# Altium project viper_eagle_rep.PrjPcb
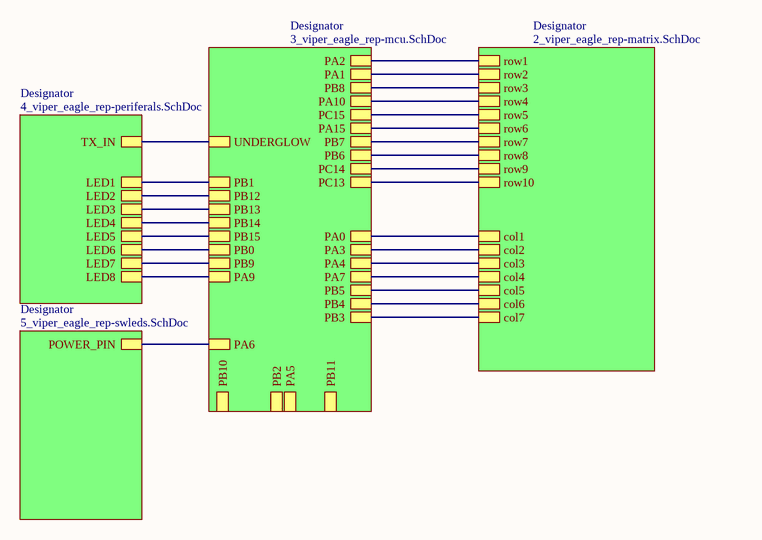
[diagram p0: 1_viper_eagle_rep_top.SchDoc]
Revision: B2; ProjectTitle: Viper/Eagle Rep
5 sheets, 371 parts. Net scope: hierarchical (ports join the sheet entries above them; power ports are global).
Board file: viper_eagle_rep.PcbDoc
Sheets:
  1_viper_eagle_rep_top.SchDoc
    Designator = 3_viper_eagle_rep-mcu.SchDoc
    Designator = 2_viper_eagle_rep-matrix.SchDoc
    Designator = 4_viper_eagle_rep-periferals.SchDoc
    Designator = 5_viper_eagle_rep-swleds.SchDoc

## Sheet 1_viper_eagle_rep_top.SchDoc: =ProjectTitle
size A4; Address1: github.com/4pplet/eagle_viper; Address2: Licence: CERN-OHL-S; Address4: www.4pplet.com; Revision: B2; SheetNumber: 1; SheetTotal: 5; ProjectName: waffling60

### Sub-sheets
Designator = 3_viper_eagle_rep-mcu.SchDoc: PB10, PB3, PB2, PB9, PB0, PB7, PA15, PB6, PC14, PB13, UNDERGLOW, PB12, PB11, PA0, PA6, PC15, PB1, PB4, PA10, PC13, PB5, PB14, PA9, PA1, PA2, PB15, PB8, PA4, PA3, PA5, PA7
Designator = 2_viper_eagle_rep-matrix.SchDoc: col5, col7, col3, col1, row3, row1, row4, row2, row5, col4, col2, col6, row9, row7, row6, row8, row10
Designator = 4_viper_eagle_rep-periferals.SchDoc: TX_IN, LED4, LED7, LED3, LED5, LED1, LED6, LED8, LED2
Designator = 5_viper_eagle_rep-swleds.SchDoc: POWER_PIN

### Nets
col1: sheet Designator/PA0, sheet Designator/col1
col2: sheet Designator/PA3, sheet Designator/col2
col3: sheet Designator/PA4, sheet Designator/col3
col4: sheet Designator/PA7, sheet Designator/col4
col5: sheet Designator/PB5, sheet Designator/col5
col6: sheet Designator/PB4, sheet Designator/col6
col7: sheet Designator/PB3, sheet Designator/col7
PA1: sheet Designator/PA1, sheet Designator/row2
PA2: sheet Designator/PA2, sheet Designator/row1
PA9: sheet Designator/PA9, sheet Designator/LED8
PA10: sheet Designator/PA10, sheet Designator/row4
PA15: sheet Designator/PA15, sheet Designator/row6
PB0: sheet Designator/PB0, sheet Designator/LED6
PB1: sheet Designator/PB1, sheet Designator/LED1
PB6: sheet Designator/PB6, sheet Designator/row8
PB7: sheet Designator/PB7, sheet Designator/row7
PB8: sheet Designator/PB8, sheet Designator/row3
PB9: sheet Designator/PB9, sheet Designator/LED7
PB12: sheet Designator/PB12, sheet Designator/LED2
PB13: sheet Designator/PB13, sheet Designator/LED3
PB14: sheet Designator/PB14, sheet Designator/LED4
PB15: sheet Designator/PB15, sheet Designator/LED5
PC13: sheet Designator/PC13, sheet Designator/row10
PC14: sheet Designator/PC14, sheet Designator/row9
PC15: sheet Designator/PC15, sheet Designator/row5
switch_led: sheet Designator/PA6, sheet Designator/POWER_PIN
NetLED406_4: sheet Designator/UNDERGLOW, sheet Designator/TX_IN

### Notes on the sheet
- Title
- Size:
- Date:
- A4
- Number:
- Time:
- Revision:
- Sheet
- of
- File:

## Sheet 3_viper_eagle_rep-mcu.SchDoc: =ProjectTitle
size A4; Address1: github.com/4pplet/eagle_viper; Address2: Licence: CERN-OHL-S; Address4: www.4pplet.com; Revision: B2; SheetNumber: 3; SheetTotal: 5
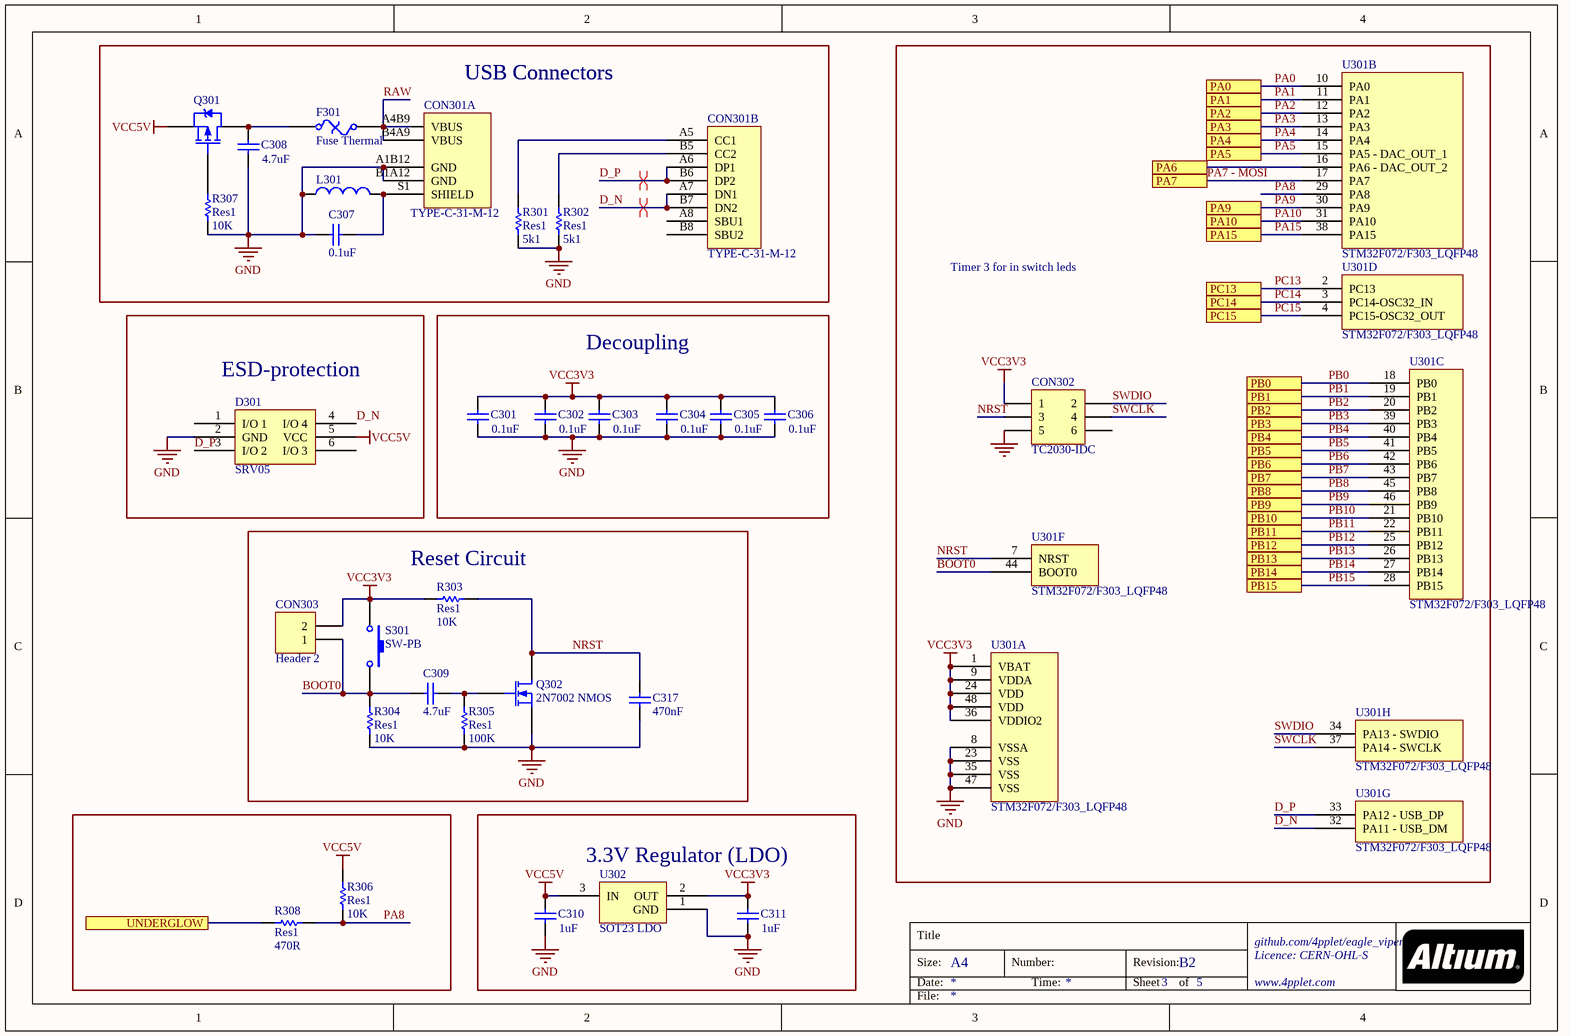
[diagram p1: 3_viper_eagle_rep-mcu.SchDoc]

### Parts
C301  value 0.1uF  [C0603[1608]]
C302  value 0.1uF  [C0603[1608]]
C303  value 0.1uF  [C0603[1608]]
C304  value 0.1uF  [C0603[1608]]
C305  value 0.1uF  [C0603[1608]]
C306  value 0.1uF  [C0603[1608]]
C307  value 0.1uF  [C0603[1608]]
C308  value 4.7uF  [C0603[1608]]
C309  value 4.7uF  [C0603[1608]]
C310  value 1uF  [C0603[1608]]
C311  value 1uF  [C0603[1608]]
C317  value 470nF  [C0603[1608]]
CON301  TYPE-C-31-M-12  [TYPE-C-31-M-12]  (parts A,B of 2)
CON302  TC2030-IDC  [TC2030-IDC-NL]  (no BOM)
CON303  Header 2  [HDR1X2]  (no BOM)
D301  SRV05  [SOT-23-6]
F301  Fuse Thermal  [C1206[3216]]
L301  Inductor  [L0805]  (value not drawn)
Q301  PMOS-2  [SOT-23-3]  (value not drawn)
Q302  2N7002 NMOS  [SOT-23-3]
R301  Res1  value 5k1  [R0603[1608]]
R302  Res1  value 5k1  [R0603[1608]]
R303  Res1  value 10K  [R0603[1608]]
R304  Res1  value 10K  [R0603[1608]]
R305  Res1  value 100K  [R0603[1608]]
R306  Res1  value 10K  [R0603[1608]]
R307  Res1  value 10K  [R0603[1608]]
R308  Res1  value 470R  [R0603[1608]]
S301  SW-PB  [XKB Switch]
U301  STM32F072/F303_LQFP48  [STM32 - COMBO 7X7MM]  (parts A,B,C,D,F,G,H of 8)
U302  SOT23 LDO  [SOT-23-3]

### Blocks framed on the sheet
Timer 3 for in switch leds: CON302 U301
ESD-protection: D301
Decoupling: C301-C306
Reset Circuit: C309 C317 CON303 Q302 R303-R305 S301
3.3V Regulator (LDO): C310 C311 U302

### Ports
PA0, PA1, PA2, PA3, PA4, PA5, PA6, PA7, PA9, PA10, PA15, PB0, PB1, PB2, PB3, PB4, PB5, PB6, PB7, PB8, PB9, PB10, PB11, PB12, PB13, PB14, PB15, PC13, PC14, PC15, UNDERGLOW

### Nets
GND: C301.1 C302.1 C303.1 C304.1 C305.1 C306.1 C307.1 C308.1 C310.1 C311.1 C317.2 CON301.A1B12(GND) CON301.B1A12(GND) CON302.5 D301.2(GND) L301.1 Q302.2(S) R301.2 R302.2 R304.2 R305.2 R307.2 U301.8(VSSA) U301.23(VSS) U301.35(VSS) U301.47(VSS) U302.1(GND)
VCC3V3: C301.2 C302.2 C303.2 C304.2 C305.2 C306.2 C311.2 CON302.1 CON303.2 R303.1 S301.1 U301.1(VBAT) U301.9(VDDA) U301.24(VDD) U301.36(VDDIO2) U301.48(VDD) U302.2(OUT)
VCC5V: C310.2 D301.5(VCC) Q301.2(S) R306.1 U302.3(IN)
BOOT0: C309.2 CON303.1 R304.1 S301.2 U301.44(BOOT0)
D_N: CON301.A7(DN1) CON301.B7(DN2) D301.4(I/O_4) U301.32(PA11_-_USB_DM)
D_P: CON301.A6(DP1) CON301.B6(DP2) D301.3(I/O_2) U301.33(PA12_-_USB_DP)
NRST: C317.1 CON302.3 Q302.3(D) R303.2 U301.7(NRST)
PA0: U301.10(PA0) ; port PA0  [project net col1]
PA1: U301.11(PA1) ; port PA1
PA2: U301.12(PA2) ; port PA2
PA3: U301.13(PA3) ; port PA3  [project net col2]
PA4: U301.14(PA4) ; port PA4  [project net col3]
PA5: U301.15(PA5_-_DAC_OUT_1) ; port PA5
PA7 - MOSI: U301.17(PA7) ; port PA7  [project net col4]
PA8: R306.2 R308.1 U301.29(PA8)
PA9: U301.30(PA9) ; port PA9
PA10: U301.31(PA10) ; port PA10
PA15: U301.38(PA15) ; port PA15
PB0: U301.18(PB0) ; port PB0
PB1: U301.19(PB1) ; port PB1
PB2: U301.20(PB2) ; port PB2
PB3: U301.39(PB3) ; port PB3  [project net col7]
PB4: U301.40(PB4) ; port PB4  [project net col6]
PB5: U301.41(PB5) ; port PB5  [project net col5]
PB6: U301.42(PB6) ; port PB6
PB7: U301.43(PB7) ; port PB7
PB8: U301.45(PB8) ; port PB8
PB9: U301.46(PB9) ; port PB9
PB10: U301.21(PB10) ; port PB10
PB11: U301.22(PB11) ; port PB11
PB12: U301.25(PB12) ; port PB12
PB13: U301.26(PB13) ; port PB13
PB14: U301.27(PB14) ; port PB14
PB15: U301.28(PB15) ; port PB15
PC13: U301.2(PC13) ; port PC13
PC14: U301.3(PC14-OSC32_IN) ; port PC14
PC15: U301.4(PC15-OSC32_OUT) ; port PC15
RAW: CON301.A4B9(VBUS) CON301.B4A9(VBUS) F301.2
SWCLK: CON302.4 U301.37(PA14_-_SWCLK)
SWDIO: CON302.2 U301.34(PA13_-_SWDIO)
switch_led: U301.16(PA6_-_DAC_OUT_2) ; port PA6
NetC307_2: C307.2 CON301.S1(SHIELD) L301.2
NetC308_2: C308.2 F301.1 Q301.3(D)
NetC309_1: C309.1 Q302.1(G) R305.1
NetCON301_A5: CON301.A5(CC1) R301.1
NetCON301_B5: CON301.B5(CC2) R302.1
NetLED406_4: R308.2 ; port UNDERGLOW
NetQ301_1: Q301.1(G) R307.1

Not connected (* = marked no-connect by the designer): CON301 A8(SBU1) B8(SBU2); CON302 6; D301 1(I/O_1) 6(I/O_3)

### Layout directives
differential pair: D_N, D_P

### Notes on the sheet
- USB Connectors
- Title
- Size:
- Date:
- A4
- Number:
- Time:
- Revision:
- Sheet
- of
- File:

### Library data of the parts
C301-C307 = Cap: Capacitor; MRF.Part: CC0603KRX7R9BB104; LCSC MFG: YAGEO; Version: 0603 imperial; LCSC Part #: C14663
C308 C309 = Cap: Capacitor; MRF.Part: CL10A475KO8NNNC; LCSC MFG: Samsung Electro-Mechanics; Version: 0603 imperial; LCSC Part #: C19666
C310 C311 = Cap: Capacitor; MRF.Part: CL10A105KB8NNNC; LCSC MFG: Samsung Electro-Mechanics; Version: 0603 imperial; LCSC Part #: C15849
C317 = Cap: Capacitor; MRF.Part: CL10B474KA8NNNC; LCSC MFG: Samsung Electro-Mechanics; Version: 0603 imperial; LCSC Part #: C1623
CON301 = TYPE-C-31-M-12: LCSC MFG: Korean Hroparts Elec; LCSC Part #: C165948; MRF.Part: TYPE-C-31-M-12
CON302 = Header 3X2: Header, 3-Pin, Dual row
CON303 = Header 2: Header, 2-Pin
D301 = SRV05: MRF.Part: SRV05-4-P-T7; LCSC MFG: ProTek Devices; LCSC Part #: C85364
F301 = Fuse Thermal: Thermal Fuse; MRF.Part: ASMD1206-050; LCSC MFG: Shenzhen JDT Fuse; LCSC Part #: C135338
L301 = Inductor: MRF.Part: GZ2012D101TF; LCSC MFG: Sunlord; LCSC Part #: C1015; Version: 0806 imperial
Q301 = PMOS-2: P-Channel Power MOSFET; MRF.Part: SI2301CDS-T1-GE3; LCSC MFG: Vishay Intertech; LCSC Part #: C10487; Version: SOT23-3
Q302 = MOSFET-N: N-Channel MOSFET; LCSC MFG: Changjiang Electronics Tech (CJ); LCSC Part #: C8545; MRF.Part: 2N7002
R301 R302 = Res1: Resistor; MRF.Part: 0603WAF5101T5E; LCSC MFG: Uniroyal Elec; Version: 0603 imperial; LCSC Part #: C23186
R303 R304 R306 R307 = Res1: Resistor; MRF.Part: 0603WAF1002T5E; LCSC MFG: Uniroyal Elec; Version: 0603 imperial; LCSC Part #: C25804
R305 = Res1: Resistor; MRF.Part: 0603WAF1003T5E; LCSC MFG: Uniroyal Elec; Version: 0603 imperial; LCSC Part #: C25803
R308 = Res1: Resistor; MRF.Part: 0603WAF4700T5E; LCSC MFG: Uniroyal Elec; Version: 0603 imperial; LCSC Part #: C23179
S301 = SW-PB: Switch; MRF.Part: TS-1187A-C-D-B; LCSC MFG: XKB Enterprise; LCSC Part #: C318888
U301 = STM32F072/F303_LQFP48: MRF.Part: APM32F072CBT6; LCSC MFG: Geehy; LCSC Part #: C915660
U302 = SOT23 LDO: MRF.Part: XC6206P332MR; LCSC MFG: Torex Semicon; LCSC Part #: C5446

## Sheet 2_viper_eagle_rep-matrix.SchDoc: =ProjectTitle
size A3; Address1: github.com/4pplet/eagle_viper; Address2: Licence: CERN-OHL-S; Address4: www.4pplet.com; Revision: B2; SheetNumber: 2; SheetTotal: 5
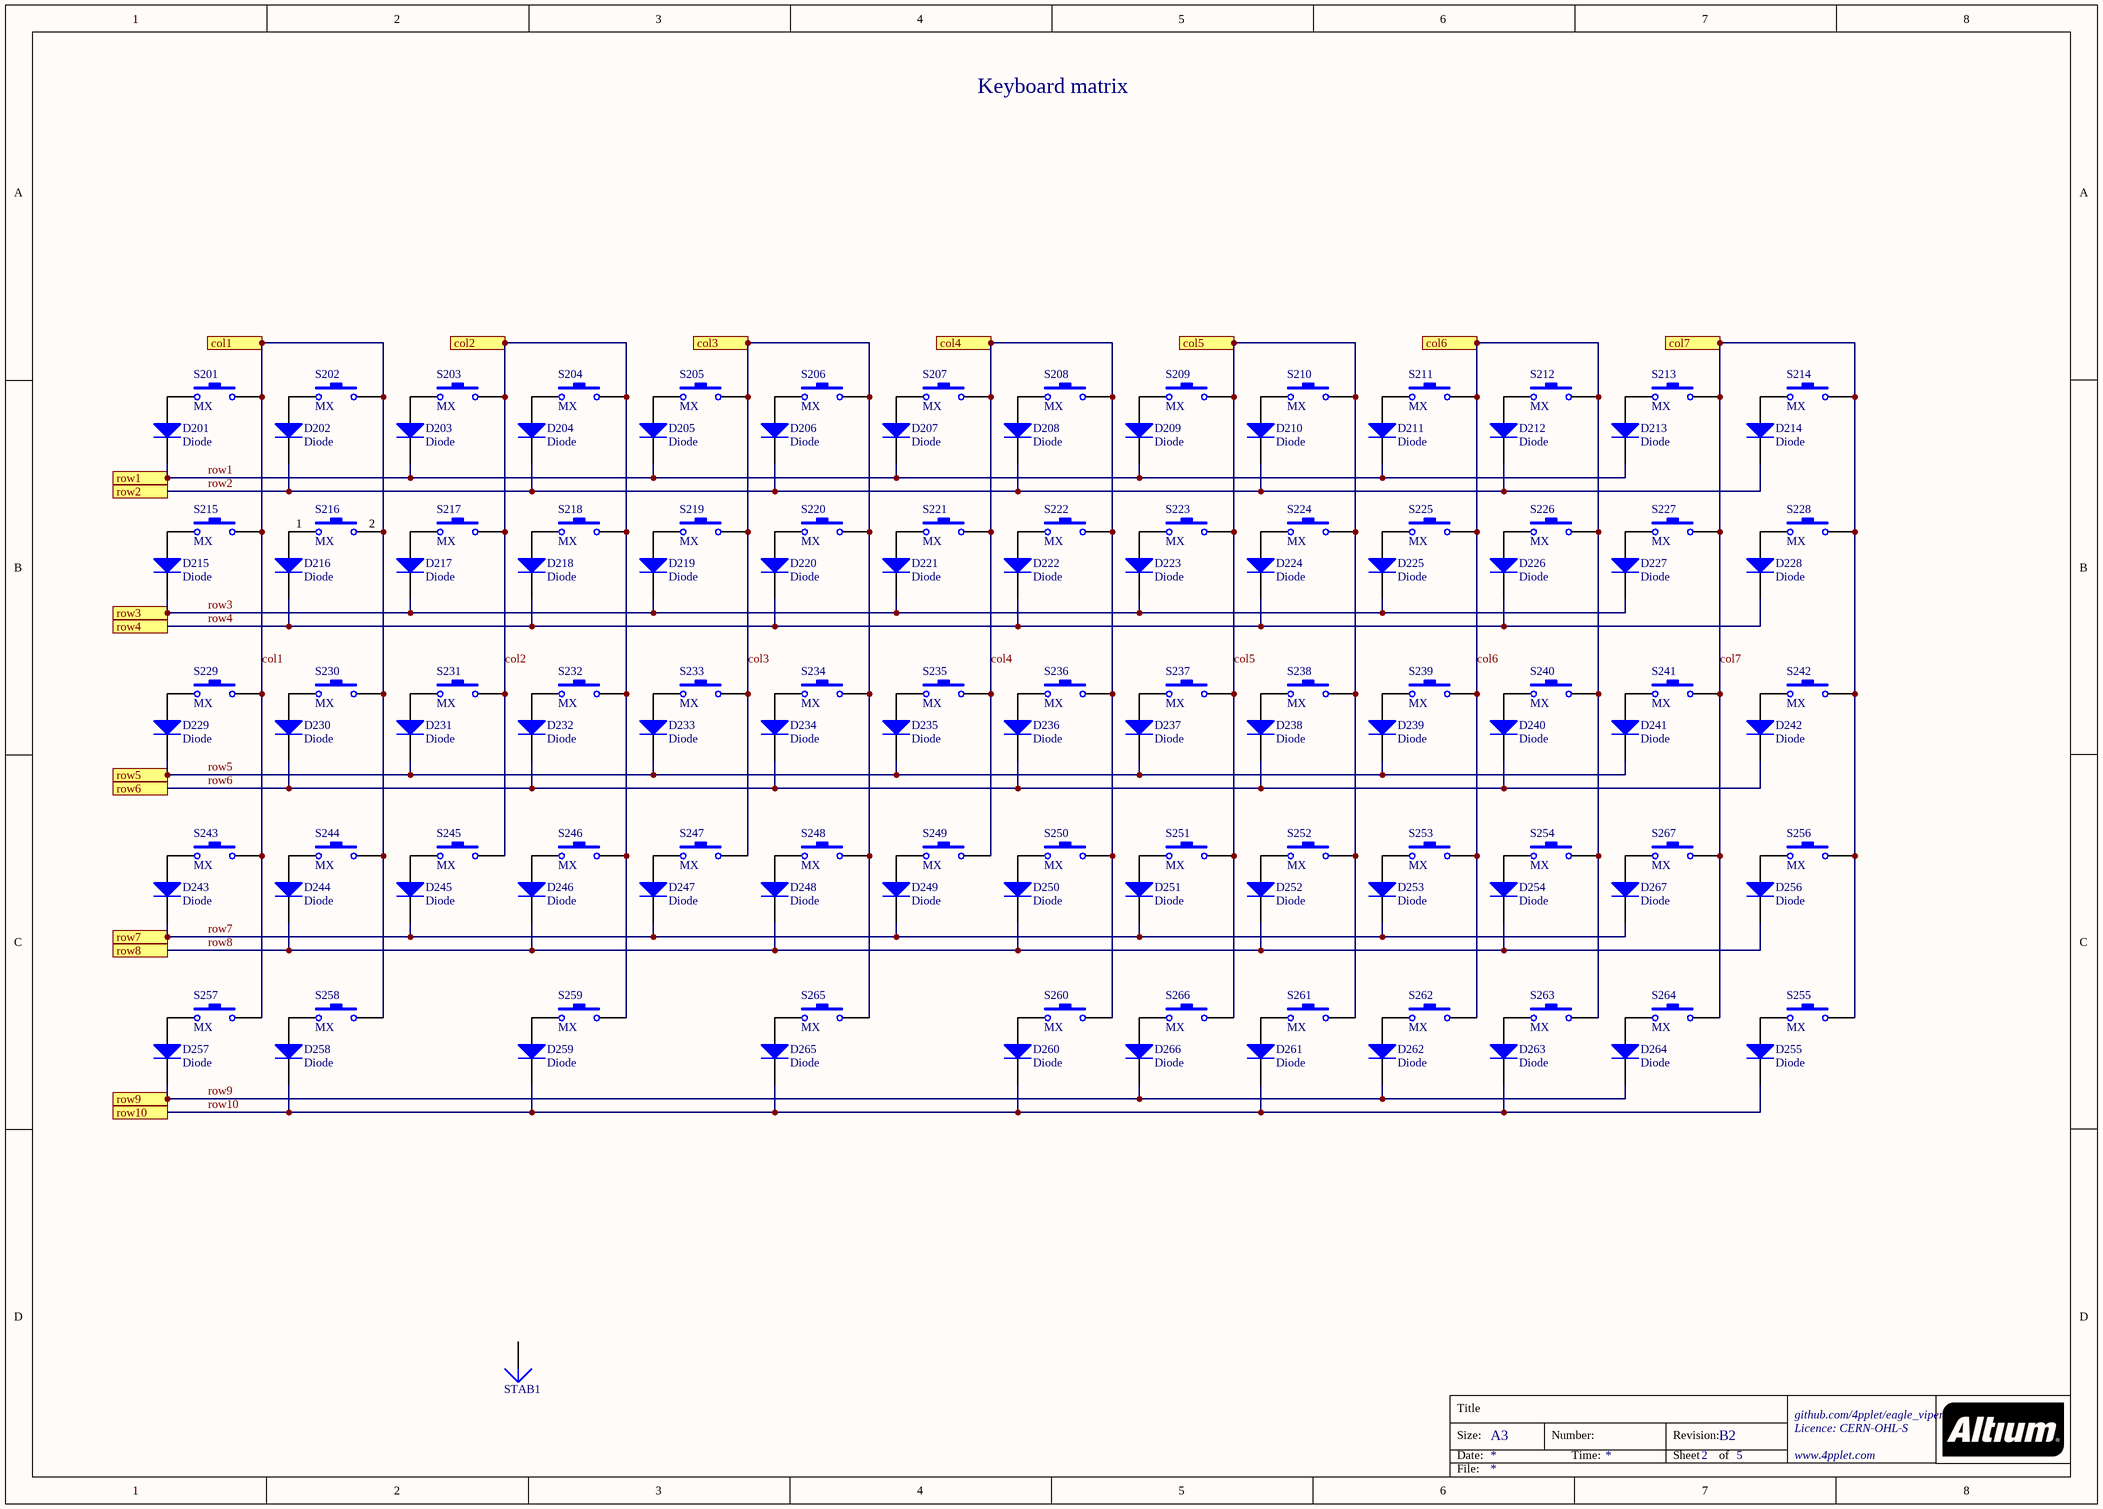
[diagram p2: 2_viper_eagle_rep-matrix.SchDoc]

### Parts
D201  Diode  [SOD-123]
D202  Diode  [SOD-123]
D203  Diode  [SOD-123]
D204  Diode  [SOD-123]
D205  Diode  [SOD-123]
D206  Diode  [SOD-123]
D207  Diode  [SOD-123]
D208  Diode  [SOD-123]
D209  Diode  [SOD-123]
D210  Diode  [SOD-123]
D211  Diode  [SOD-123]
D212  Diode  [SOD-123]
D213  Diode  [SOD-123]
D214  Diode  [SOD-123]
D215  Diode  [SOD-123]
D216  Diode  [SOD-123]
D217  Diode  [SOD-123]
D218  Diode  [SOD-123]
D219  Diode  [SOD-123]
D220  Diode  [SOD-123]
D221  Diode  [SOD-123]
D222  Diode  [SOD-123]
D223  Diode  [SOD-123]
D224  Diode  [SOD-123]
D225  Diode  [SOD-123]
D226  Diode  [SOD-123]
D227  Diode  [SOD-123]
D228  Diode  [SOD-123]
D229  Diode  [SOD-123]
D230  Diode  [SOD-123]
D231  Diode  [SOD-123]
D232  Diode  [SOD-123]
D233  Diode  [SOD-123]
D234  Diode  [SOD-123]
D235  Diode  [SOD-123]
D236  Diode  [SOD-123]
D237  Diode  [SOD-123]
D238  Diode  [SOD-123]
D239  Diode  [SOD-123]
D240  Diode  [SOD-123]
D241  Diode  [SOD-123]
D242  Diode  [SOD-123]
D243  Diode  [SOD-123]
D244  Diode  [SOD-123]
D245  Diode  [SOD-123]
D246  Diode  [SOD-123]
D247  Diode  [SOD-123]
D248  Diode  [SOD-123]
D249  Diode  [SOD-123]
D250  Diode  [SOD-123]
D251  Diode  [SOD-123]
D252  Diode  [SOD-123]
D253  Diode  [SOD-123]
D254  Diode  [SOD-123]
D255  Diode  [SOD-123]
D256  Diode  [SOD-123]
D257  Diode  [SOD-123]
D258  Diode  [SOD-123]
D259  Diode  [SOD-123]
D260  Diode  [SOD-123]
D261  Diode  [SOD-123]
D262  Diode  [SOD-123]
D263  Diode  [SOD-123]
D264  Diode  [SOD-123]
D265  Diode  [SOD-123]
D266  Diode  [SOD-123]
D267  Diode  [SOD-123]
S201  MX  [MX-switch - switched pol]  (no BOM)
S202  MX  [MX-switch - switched pol - connector]  (no BOM)
S203  MX  [MX-switch - switched pol]  (no BOM)
S204  MX  [MX-switch - switched pol]  (no BOM)
S205  MX  [MX-switch - switched pol]  (no BOM)
S206  MX  [MX-switch - switched pol]  (no BOM)
S207  MX  [MX-switch]  (no BOM)
S208  MX  [MX-switch - switched pol]  (no BOM)
S209  MX  [MX-switch - switched pol]  (no BOM)
S210  MX  [MX-switch - switched pol]  (no BOM)
S211  MX  [MX-switch - switched pol]  (no BOM)
S212  MX  [MX-switch - switched pol]  (no BOM)
S213  MX  [MX-switch - switched pol]  (no BOM)
S214  MX  [MX-switch]  (no BOM)
S215  MX  [MX-switch - 1.5U]  (no BOM)
S216  MX  [MX-switch - switched pol]  (no BOM)
S217  MX  [MX-switch - switched pol]  (no BOM)
S218  MX  [MX-switch - switched pol]  (no BOM)
S219  MX  [MX-switch - switched pol]  (no BOM)
S220  MX  [MX-switch]  (no BOM)
S221  MX  [MX-switch - switched pol]  (no BOM)
S222  MX  [MX-switch - switched pol]  (no BOM)
S223  MX  [MX-switch - switched pol]  (no BOM)
S224  MX  [MX-switch - switched pol]  (no BOM)
S225  MX  [MX-switch - switched pol]  (no BOM)
S226  MX  [MX-switch]  (no BOM)
S227  MX  [MX-switch - switched pol]  (no BOM)
S228  MX  [MX-switch - backspace]  (no BOM)
S229  MX  [MX-switch - CAPS]  (no BOM)
S230  MX  [MX-switch - switched pol]  (no BOM)
S231  MX  [MX-switch - switched pol]  (no BOM)
S232  MX  [MX-switch - switched pol]  (no BOM)
S233  MX  [MX-switch - switched pol]  (no BOM)
S234  MX  [MX-switch - switched pol]  (no BOM)
S235  MX  [MX-switch - switched pol]  (no BOM)
S236  MX  [MX-switch - switched pol]  (no BOM)
S237  MX  [MX-switch - switched pol]  (no BOM)
S238  MX  [MX-switch - switched pol]  (no BOM)
S239  MX  [MX-switch]  (no BOM)
S240  MX  [MX-switch - switched pol]  (no BOM)
S241  MX  [MX-switch]  (no BOM)
S242  MX  [MX-switch - 1.5U]  (no BOM)
S243  MX  [MX-switch - Left shift]  (no BOM)
S244  MX  [MX-switch]  (no BOM)
S245  MX  [MX-switch - switched pol]  (no BOM)
S246  MX  [MX-switch - switched pol]  (no BOM)
S247  MX  [MX-switch - switched pol]  (no BOM)
S248  MX  [MX-switch - switched pol]  (no BOM)
S249  MX  [MX-switch - switched pol]  (no BOM)
S250  MX  [MX-switch - switched pol]  (no BOM)
S251  MX  [MX-switch - switched pol]  (no BOM)
S252  MX  [MX-switch - switched pol]  (no BOM)
S253  MX  [MX-switch - switched pol]  (no BOM)
S254  MX  [MX-switch - switched pol]  (no BOM)
S255  MX  [MX-switch]  (no BOM)
S256  MX  [MX-switch - Enter - rotated ISO]  (no BOM)
S257  MX  [MX-switch - 1.5u MOD-L]  (no BOM)
S258  MX  [MX-switch - 1u MOD-L]  (no BOM)
S259  MX  [MX-switch - 1.5u MOD-L]  (no BOM)
S260  MX  [MX-switch - Space_V2]  (no BOM)
S261  MX  [MX-switch]  (no BOM)
S262  MX  [MX-switch - 1.5u MOD-R]  (no BOM)
S263  MX  [MX-switch - 1u MOD-R]  (no BOM)
S264  MX  [MX-switch - 1.5u MOD-R]  (no BOM)
S265  MX  [MX-switch - 3U - rotated stab]  (no BOM)
S266  MX  [MX-switch - 3U - rotated stab]  (no BOM)
S267  MX  [MX-switch - right shift - rotated stab]  (no BOM)
STAB1  Plug  [Stab 10U]  (value not drawn)  (no BOM)

### Ports
col1, col2, col3, col4, col5, col6, col7, row1, row2, row3, row4, row5, row6, row7, row8, row9, row10

### Nets
col1: S201.2 S202.2 S215.1 S216.2 S229.2 S230.2 S243.2 S244.2 S257.1 S258.2 ; port col1
col2: S203.2 S204.2 S217.2 S218.2 S231.2 S232.2 S245.2 S246.2 S259.1 ; port col2
col3: S205.2 S206.2 S219.2 S220.2 S233.2 S234.2 S247.2 S248.2 S265.2 ; port col3
col4: S207.2 S208.2 S221.2 S222.2 S235.2 S236.2 S249.2 S250.2 S260.1 ; port col4
col5: S209.2 S210.2 S223.2 S224.2 S237.2 S238.2 S251.2 S252.2 S261.2 S266.2 ; port col5
col6: S211.2 S212.2 S225.2 S226.2 S239.2 S240.2 S253.2 S254.2 S262.1 S263.1 ; port col6
col7: S213.2 S214.2 S227.2 S228.1 S241.2 S242.2 S255.2 S256.2 S264.2 S267.2 ; port col7
row1: D201.2(K) D203.2(K) D205.2(K) D207.2(K) D209.2(K) D211.2(K) D213.2(K) ; port row1  [project net PA2]
row2: D202.2(K) D204.2(K) D206.2(K) D208.2(K) D210.2(K) D212.2(K) D214.2(K) ; port row2  [project net PA1]
row3: D215.2(K) D217.2(K) D219.2(K) D221.2(K) D223.2(K) D225.2(K) D227.2(K) ; port row3  [project net PB8]
row4: D216.2(K) D218.2(K) D220.2(K) D222.2(K) D224.2(K) D226.2(K) D228.2(K) ; port row4  [project net PA10]
row5: D229.2(K) D231.2(K) D233.2(K) D235.2(K) D237.2(K) D239.2(K) D241.2(K) ; port row5  [project net PC15]
row6: D230.2(K) D232.2(K) D234.2(K) D236.2(K) D238.2(K) D240.2(K) D242.2(K) ; port row6  [project net PA15]
row7: D243.2(K) D245.2(K) D247.2(K) D249.2(K) D251.2(K) D253.2(K) D267.2(K) ; port row7  [project net PB7]
row8: D244.2(K) D246.2(K) D248.2(K) D250.2(K) D252.2(K) D254.2(K) D256.2(K) ; port row8  [project net PB6]
row9: D257.2(K) D262.2(K) D264.2(K) D266.2(K) ; port row9  [project net PC14]
row10: D255.2(K) D258.2(K) D259.2(K) D260.2(K) D261.2(K) D263.2(K) D265.2(K) ; port row10  [project net PC13]
NetD201_1: D201.1(A) S201.1
NetD202_1: D202.1(A) S202.1
NetD203_1: D203.1(A) S203.1
NetD204_1: D204.1(A) S204.1
NetD205_1: D205.1(A) S205.1
NetD206_1: D206.1(A) S206.1
NetD207_1: D207.1(A) S207.1
NetD208_1: D208.1(A) S208.1
NetD209_1: D209.1(A) S209.1
NetD210_1: D210.1(A) S210.1
NetD211_1: D211.1(A) S211.1
NetD212_1: D212.1(A) S212.1
NetD213_1: D213.1(A) S213.1
NetD214_1: D214.1(A) S214.1
NetD215_1: D215.1(A) S215.2
NetD216_1: D216.1(A) S216.1
NetD217_1: D217.1(A) S217.1
NetD218_1: D218.1(A) S218.1
NetD219_1: D219.1(A) S219.1
NetD220_1: D220.1(A) S220.1
NetD221_1: D221.1(A) S221.1
NetD222_1: D222.1(A) S222.1
NetD223_1: D223.1(A) S223.1
NetD224_1: D224.1(A) S224.1
NetD225_1: D225.1(A) S225.1
NetD226_1: D226.1(A) S226.1
NetD227_1: D227.1(A) S227.1
NetD228_1: D228.1(A) S228.2
NetD229_1: D229.1(A) S229.1
NetD230_1: D230.1(A) S230.1
NetD231_1: D231.1(A) S231.1
NetD232_1: D232.1(A) S232.1
NetD233_1: D233.1(A) S233.1
NetD234_1: D234.1(A) S234.1
NetD235_1: D235.1(A) S235.1
NetD236_1: D236.1(A) S236.1
NetD237_1: D237.1(A) S237.1
NetD238_1: D238.1(A) S238.1
NetD239_1: D239.1(A) S239.1
NetD240_1: D240.1(A) S240.1
NetD241_1: D241.1(A) S241.1
NetD242_1: D242.1(A) S242.1
NetD243_1: D243.1(A) S243.1
NetD244_1: D244.1(A) S244.1
NetD245_1: D245.1(A) S245.1
NetD246_1: D246.1(A) S246.1
NetD247_1: D247.1(A) S247.1
NetD248_1: D248.1(A) S248.1
NetD249_1: D249.1(A) S249.1
NetD250_1: D250.1(A) S250.1
NetD251_1: D251.1(A) S251.1
NetD252_1: D252.1(A) S252.1
NetD253_1: D253.1(A) S253.1
NetD254_1: D254.1(A) S254.1
NetD255_1: D255.1(A) S255.1
NetD256_1: D256.1(A) S256.1
NetD257_1: D257.1(A) S257.2
NetD258_1: D258.1(A) S258.1
NetD259_1: D259.1(A) S259.2
NetD260_1: D260.1(A) S260.2
NetD261_1: D261.1(A) S261.1
NetD262_1: D262.1(A) S262.2
NetD263_1: D263.1(A) S263.2
NetD264_1: D264.1(A) S264.1
NetD265_1: D265.1(A) S265.1
NetD266_1: D266.1(A) S266.1
NetD267_1: D267.1(A) S267.1

Not connected (* = marked no-connect by the designer): STAB1 1

### Notes on the sheet
- Keyboard matrix
- Title
- Size:
- Date:
- A3
- Number:
- Time:
- Revision:
- Sheet
- of
- File:

### Library data of the parts
D201-D267 = Diode: Default Diode; MRF.Part: 1N4148W; LCSC MFG: ST(Semtech); Version: SOD-123; LCSC Part #: C81598
S201-S214 S216-S267 = SW-PB: Switch
S215 = SW-PB: TAB

## Sheet 4_viper_eagle_rep-periferals.SchDoc: =ProjectTitle
size A4; Address1: github.com/4pplet/eagle_viper; Address2: Licence: CERN-OHL-S; Address4: www.4pplet.com; Revision: B2; SheetNumber: 4; SheetTotal: 5
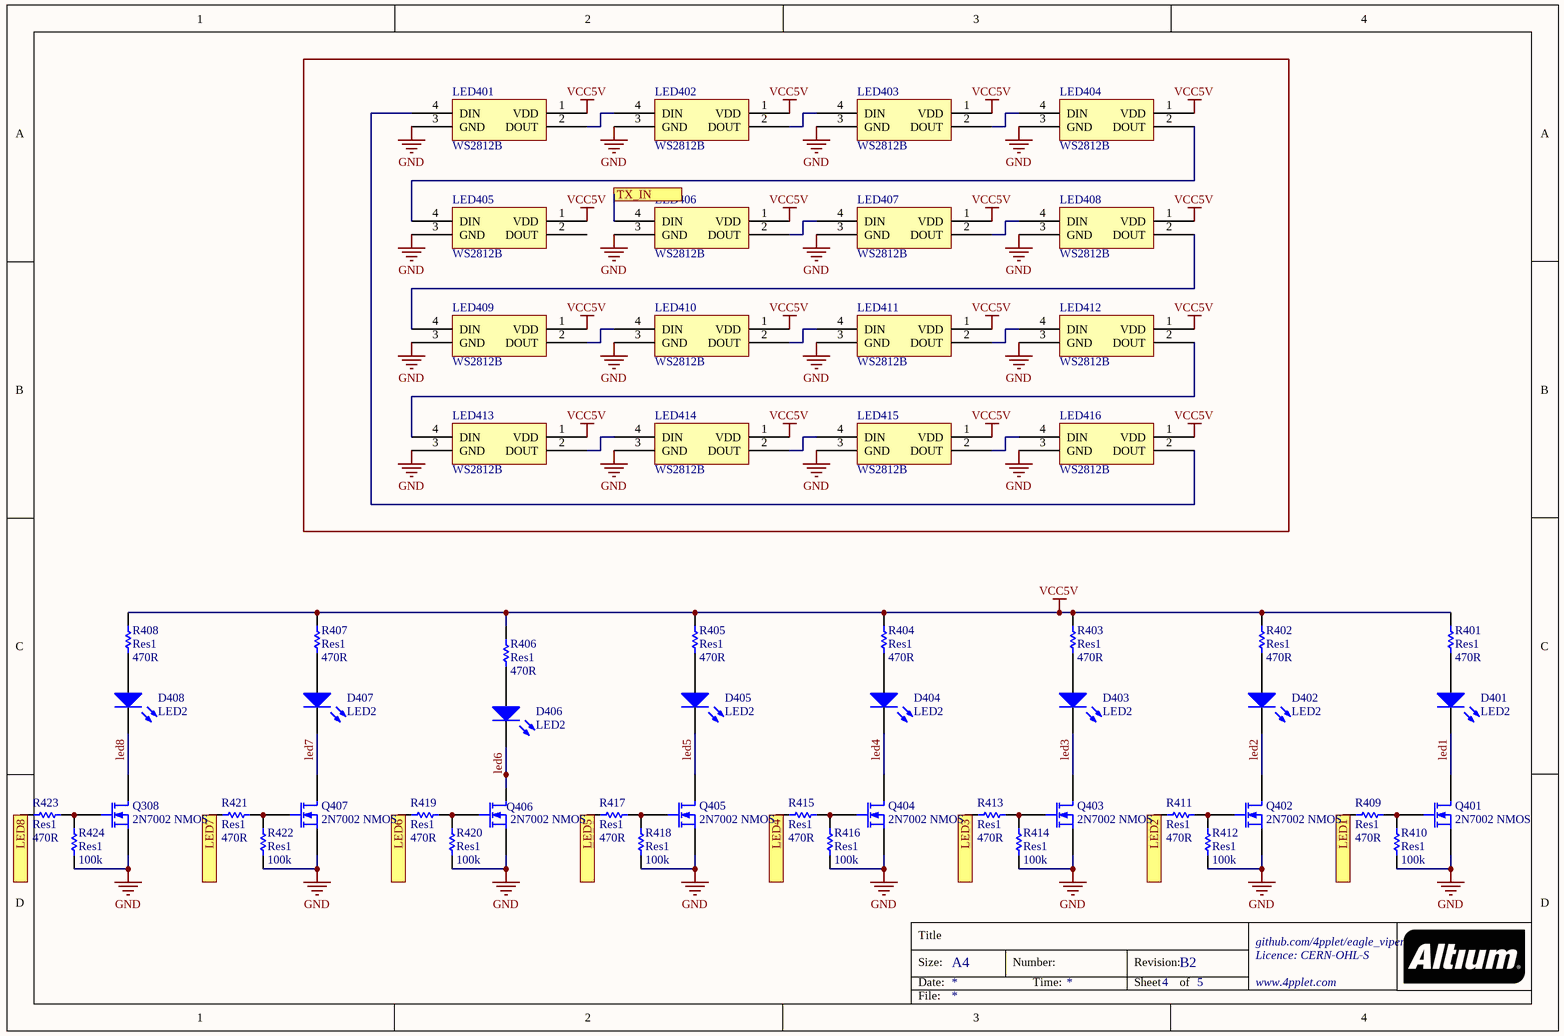
[diagram p3: 4_viper_eagle_rep-periferals.SchDoc]

### Parts
D401  LED2  [LED - THT]
D402  LED2  [LED - THT]
D403  LED2  [LED - THT]
D404  LED2  [LED - THT]
D405  LED2  [LED - THT]
D406  LED2  [LED - THT]
D407  LED2  [LED - THT]
D408  LED2  [LED - THT]
LED401  WS2812B  [WS2812B]
LED402  WS2812B  [WS2812B]
LED403  WS2812B  [WS2812B]
LED404  WS2812B  [WS2812B]
LED405  WS2812B  [WS2812B]
LED406  WS2812B  [WS2812B]
LED407  WS2812B  [WS2812B]
LED408  WS2812B  [WS2812B]
LED409  WS2812B  [WS2812B]
LED410  WS2812B  [WS2812B]
LED411  WS2812B  [WS2812B]
LED412  WS2812B  [WS2812B]
LED413  WS2812B  [WS2812B]
LED414  WS2812B  [WS2812B]
LED415  WS2812B  [WS2812B]
LED416  WS2812B  [WS2812B]
Q308  2N7002 NMOS  [SOT-23-3]
Q401  2N7002 NMOS  [SOT-23-3]
Q402  2N7002 NMOS  [SOT-23-3]
Q403  2N7002 NMOS  [SOT-23-3]
Q404  2N7002 NMOS  [SOT-23-3]
Q405  2N7002 NMOS  [SOT-23-3]
Q406  2N7002 NMOS  [SOT-23-3]
Q407  2N7002 NMOS  [SOT-23-3]
R401  Res1  value 470R  [R0603[1608]]
R402  Res1  value 470R  [R0603[1608]]
R403  Res1  value 470R  [R0603[1608]]
R404  Res1  value 470R  [R0603[1608]]
R405  Res1  value 470R  [R0603[1608]]
R406  Res1  value 470R  [R0603[1608]]
R407  Res1  value 470R  [R0603[1608]]
R408  Res1  value 470R  [R0603[1608]]
R409  Res1  value 470R  [R0603[1608]]
R410  Res1  value 100k  [R0603[1608]]
R411  Res1  value 470R  [R0603[1608]]
R412  Res1  value 100k  [R0603[1608]]
R413  Res1  value 470R  [R0603[1608]]
R414  Res1  value 100k  [R0603[1608]]
R415  Res1  value 470R  [R0603[1608]]
R416  Res1  value 100k  [R0603[1608]]
R417  Res1  value 470R  [R0603[1608]]
R418  Res1  value 100k  [R0603[1608]]
R419  Res1  value 470R  [R0603[1608]]
R420  Res1  value 100k  [R0603[1608]]
R421  Res1  value 470R  [R0603[1608]]
R422  Res1  value 100k  [R0603[1608]]
R423  Res1  value 470R  [R0603[1608]]
R424  Res1  value 100k  [R0603[1608]]

### Ports
LED1, LED2, LED3, LED4, LED5, LED6, LED7, LED8, TX_IN

### Nets
GND: LED401.3(GND) LED402.3(GND) LED403.3(GND) LED404.3(GND) LED405.3(GND) LED406.3(GND) LED407.3(GND) LED408.3(GND) LED409.3(GND) LED410.3(GND) LED411.3(GND) LED412.3(GND) LED413.3(GND) LED414.3(GND) LED415.3(GND) LED416.3(GND) Q308.2(S) Q401.2(S) Q402.2(S) Q403.2(S) Q404.2(S) Q405.2(S) Q406.2(S) Q407.2(S) R410.2 R412.2 R414.2 R416.2 R418.2 R420.2 R422.2 R424.2
VCC5V: LED401.1(VDD) LED402.1(VDD) LED403.1(VDD) LED404.1(VDD) LED405.1(VDD) LED406.1(VDD) LED407.1(VDD) LED408.1(VDD) LED409.1(VDD) LED410.1(VDD) LED411.1(VDD) LED412.1(VDD) LED413.1(VDD) LED414.1(VDD) LED415.1(VDD) LED416.1(VDD) R401.1 R402.1 R403.1 R404.1 R405.1 R406.1 R407.1 R408.1
led1: D401.2(K) Q401.3(D)
led2: D402.2(K) Q402.3(D)
led3: D403.2(K) Q403.3(D)
led4: D404.2(K) Q404.3(D)
led5: D405.2(K) Q405.3(D)
led6: D406.2(K) Q406.3(D)
led7: D407.2(K) Q407.3(D)
led8: D408.2(K) Q308.3(D)
PA9: R423.1 ; port LED8
PB0: R419.1 ; port LED6
PB1: R409.1 ; port LED1
PB9: R421.1 ; port LED7
PB12: R411.1 ; port LED2
PB13: R413.1 ; port LED3
PB14: R415.1 ; port LED4
PB15: R417.1 ; port LED5
NetD401_1: D401.1(A) R401.2
NetD402_1: D402.1(A) R402.2
NetD403_1: D403.1(A) R403.2
NetD404_1: D404.1(A) R404.2
NetD405_1: D405.1(A) R405.2
NetD406_1: D406.1(A) R406.2
NetD407_1: D407.1(A) R407.2
NetD408_1: D408.1(A) R408.2
NetLED401_2: LED401.2(DOUT) LED402.4(DIN)
NetLED401_4: LED401.4(DIN) LED416.2(DOUT)
NetLED402_2: LED402.2(DOUT) LED403.4(DIN)
NetLED403_2: LED403.2(DOUT) LED404.4(DIN)
NetLED404_2: LED404.2(DOUT) LED405.4(DIN)
NetLED406_2: LED406.2(DOUT) LED407.4(DIN)
NetLED406_4: LED406.4(DIN) ; port TX_IN
NetLED407_2: LED407.2(DOUT) LED408.4(DIN)
NetLED408_2: LED408.2(DOUT) LED409.4(DIN)
NetLED409_2: LED409.2(DOUT) LED410.4(DIN)
NetLED410_2: LED410.2(DOUT) LED411.4(DIN)
NetLED411_2: LED411.2(DOUT) LED412.4(DIN)
NetLED412_2: LED412.2(DOUT) LED413.4(DIN)
NetLED413_2: LED413.2(DOUT) LED414.4(DIN)
NetLED414_2: LED414.2(DOUT) LED415.4(DIN)
NetLED415_2: LED415.2(DOUT) LED416.4(DIN)
NetQ308_1: Q308.1(G) R423.2 R424.1
NetQ401_1: Q401.1(G) R409.2 R410.1
NetQ402_1: Q402.1(G) R411.2 R412.1
NetQ403_1: Q403.1(G) R413.2 R414.1
NetQ404_1: Q404.1(G) R415.2 R416.1
NetQ405_1: Q405.1(G) R417.2 R418.1
NetQ406_1: Q406.1(G) R419.2 R420.1
NetQ407_1: Q407.1(G) R421.2 R422.1

Not connected (* = marked no-connect by the designer): LED405 2(DOUT)

### Notes on the sheet
- Title
- Size:
- Date:
- A4
- Number:
- Time:
- Revision:
- Sheet
- of
- File:

### Library data of the parts
D401-D408 = LED2: Typical RED, GREEN, YELLOW, AMBER GaAs LED
LED401-LED416 = WS2812B: MRF.Part: WS2812B-V5/W; LCSC MFG: Worldsemi; LCSC Part #: C2874885
Q308 Q401-Q407 = MOSFET-N: as Q302 on sheet 3_viper_eagle_rep-mcu; LCSC Part #: C8545; MRF.Part: 2N7002
R401-R409 R411 R413 R415 R417 R419 R421 R423 = Res1: as R308 on sheet 3_viper_eagle_rep-mcu; Version: 0603 imperial; LCSC Part #: C23179
R410 R412 R414 R416 R418 R420 R422 R424 = Res1: as R305 on sheet 3_viper_eagle_rep-mcu; Version: 0603 imperial; LCSC Part #: C25803

## Sheet 5_viper_eagle_rep-swleds.SchDoc: =ProjectTitle
size A3; Address1: github.com/4pplet/eagle_viper; Address2: Licence: CERN-OHL-S; Address4: www.4pplet.com; Revision: B2; SheetNumber: 5; SheetTotal: 5
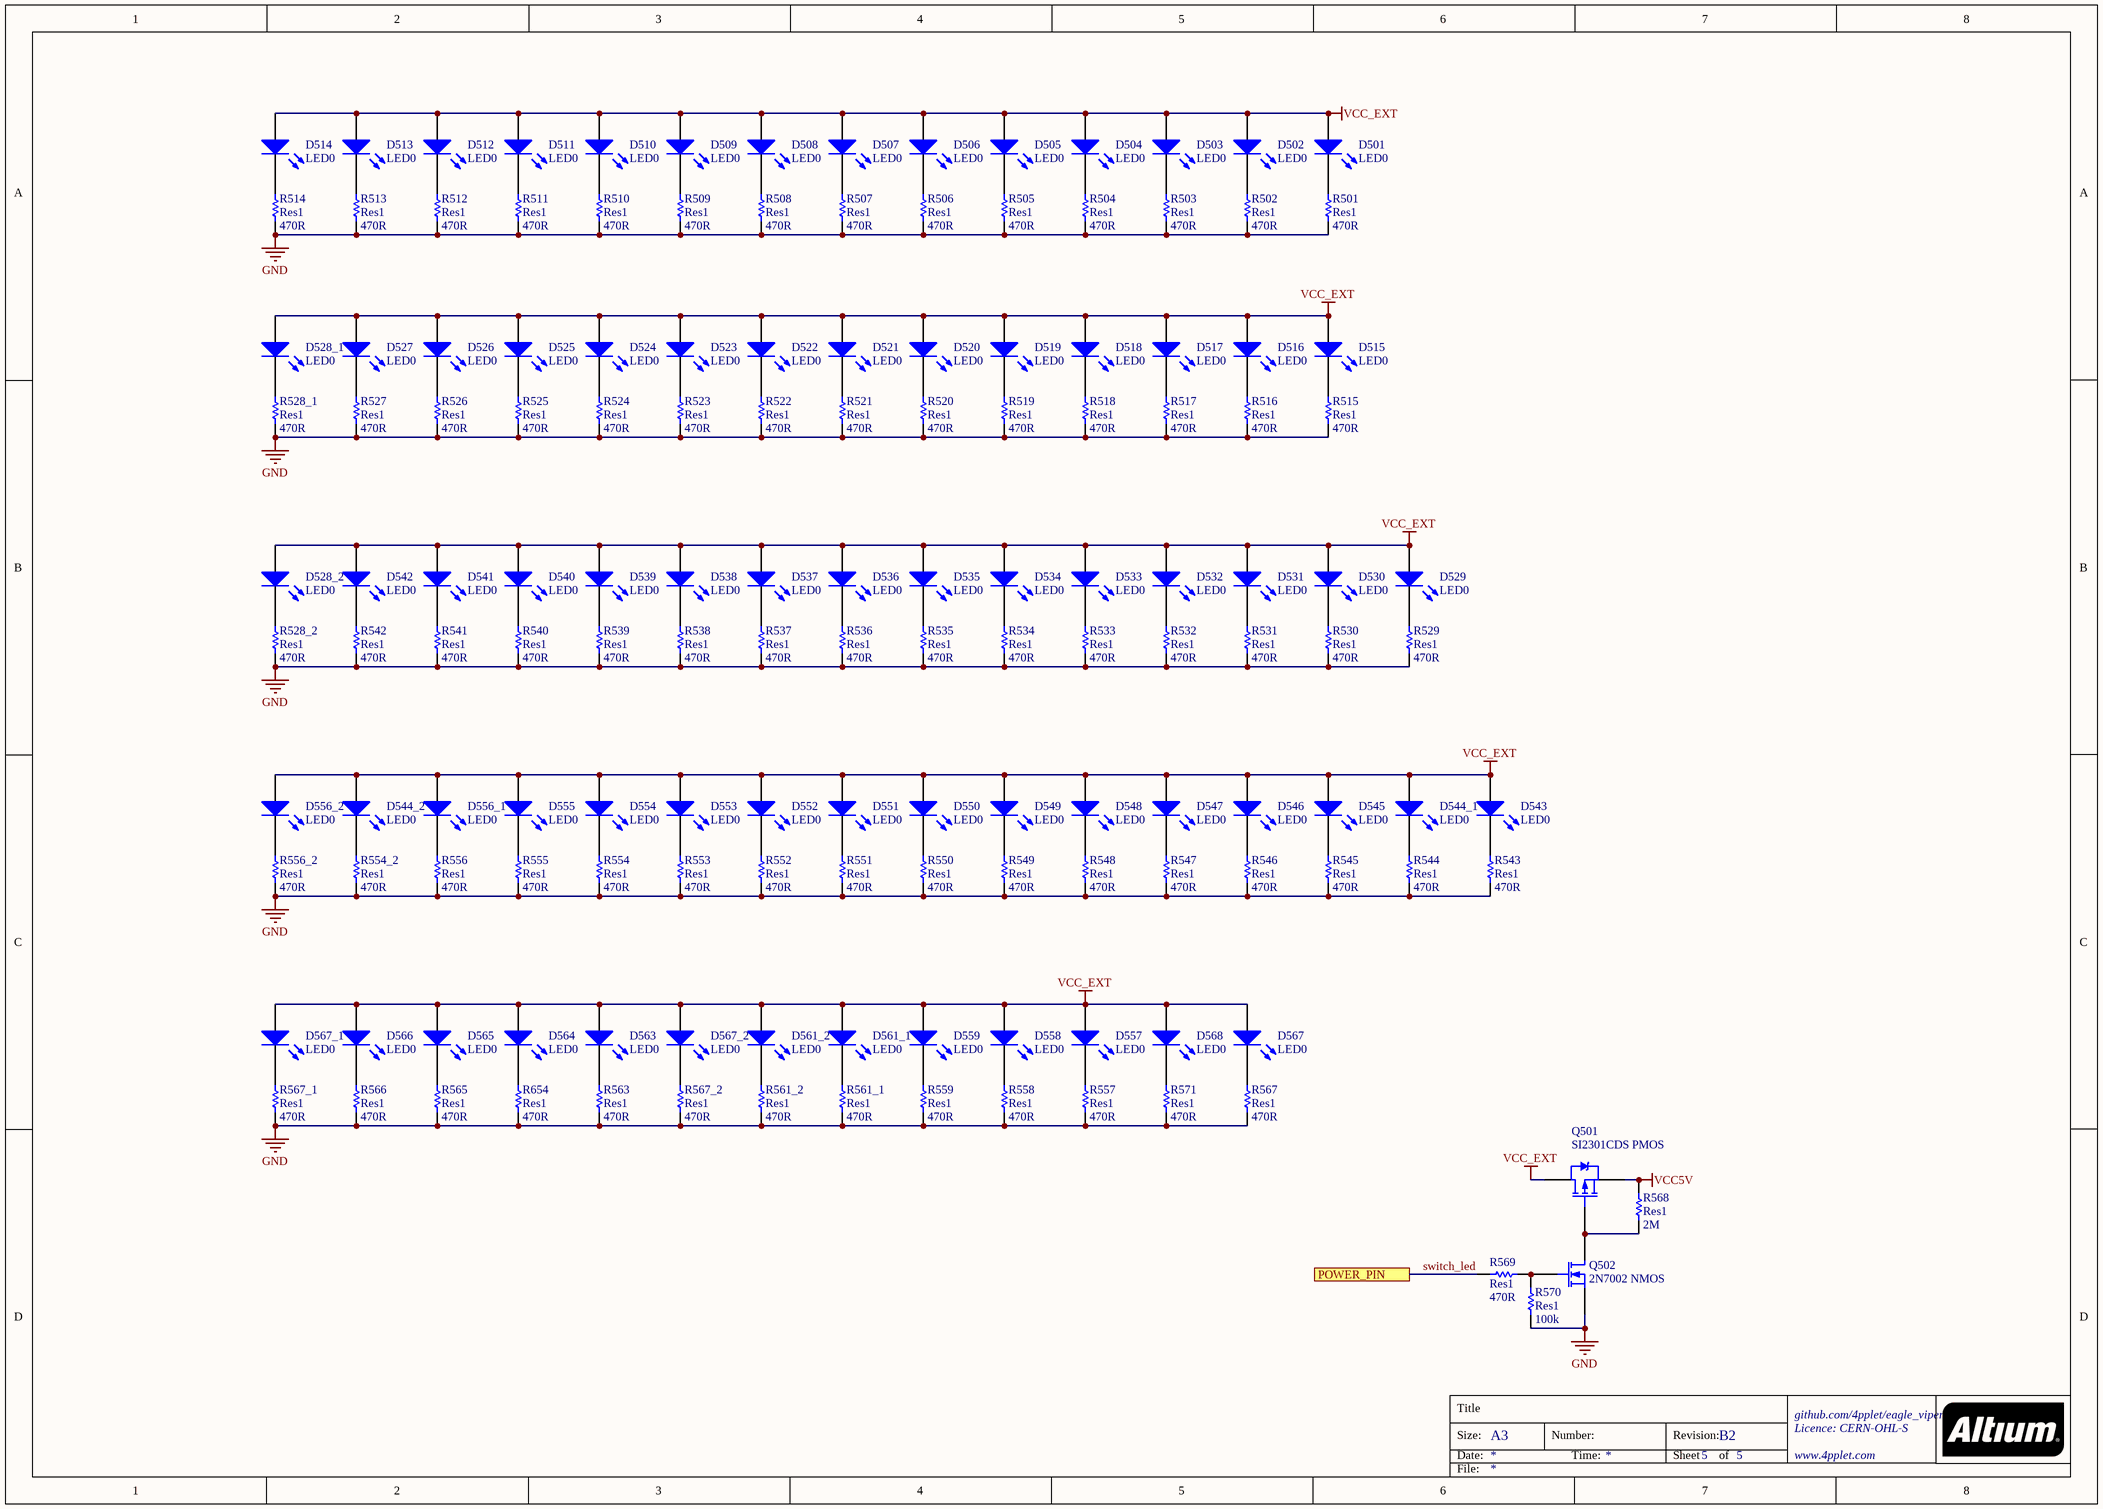
[diagram p4: 5_viper_eagle_rep-swleds.SchDoc]

### Parts
D501  LED0  [MX-switch - LED]
D502  LED0  [MX-switch - LED]
D503  LED0  [MX-switch - LED]
D504  LED0  [MX-switch - LED]
D505  LED0  [MX-switch - LED]
D506  LED0  [MX-switch - LED]
D507  LED0  [MX-switch - LED]
D508  LED0  [MX-switch - LED]
D509  LED0  [MX-switch - LED]
D510  LED0  [MX-switch - LED]
D511  LED0  [MX-switch - LED]
D512  LED0  [MX-switch - LED]
D513  LED0  [MX-switch - LED]
D514  LED0  [MX-switch - LED]
D515  LED0  [MX-switch - LED]
D516  LED0  [MX-switch - LED]
D517  LED0  [MX-switch - LED]
D518  LED0  [MX-switch - LED]
D519  LED0  [MX-switch - LED]
D520  LED0  [MX-switch - LED]
D521  LED0  [MX-switch - LED]
D522  LED0  [MX-switch - LED]
D523  LED0  [MX-switch - LED]
D524  LED0  [MX-switch - LED]
D525  LED0  [MX-switch - LED]
D526  LED0  [MX-switch - LED]
D527  LED0  [MX-switch - LED]
D528_1  LED0  [MX-switch - LED]
D528_2  LED0  [MX-switch - LED]
D529  LED0  [MX-switch - CAPS - LED NO SWITCH]
D530  LED0  [MX-switch - LED]
D531  LED0  [MX-switch - LED]
D532  LED0  [MX-switch - LED]
D533  LED0  [MX-switch - LED]
D534  LED0  [MX-switch - LED]
D535  LED0  [MX-switch - LED]
D536  LED0  [MX-switch - LED]
D537  LED0  [MX-switch - LED]
D538  LED0  [MX-switch - LED]
D539  LED0  [MX-switch - LED]
D540  LED0  [MX-switch - LED]
D541  LED0  [MX-switch - LED]
D542  LED0  [MX-switch - LED]
D543  LED0  [MX-switch - LED]
D544_1  LED0  [MX-switch - LED]
D544_2  LED0  [MX-switch - LED]
D545  LED0  [MX-switch - LED]
D546  LED0  [MX-switch - LED]
D547  LED0  [MX-switch - LED]
D548  LED0  [MX-switch - LED]
D549  LED0  [MX-switch - LED]
D550  LED0  [MX-switch - LED]
D551  LED0  [MX-switch - LED]
D552  LED0  [MX-switch - LED]
D553  LED0  [MX-switch - LED]
D554  LED0  [MX-switch - LED]
D555  LED0  [MX-switch - LED]
D556_1  LED0  [MX-switch - LED]
D556_2  LED0  [MX-switch - LED]
D557  LED0  [MX-switch - LED - MODS]
D558  LED0  [MX-switch - LED - MODS]
D559  LED0  [MX-switch - LED - MODS]
D561_1  LED0  [MX-switch - LED]
D561_2  LED0  [MX-switch - LED]
D563  LED0  [MX-switch - LED]
D564  LED0  [MX-switch - LED - MODS]
D565  LED0  [MX-switch - LED - MODS]
D566  LED0  [MX-switch - LED - MODS]
D567  LED0  [SWITCH_LED - 1U]
D567_1  LED0  [MX-switch - LED]
D567_2  LED0  [MX-switch - LED]
D568  LED0  [SWITCH_LED - 1U]
Q501  SI2301CDS PMOS  [SOT-23-3]
Q502  2N7002 NMOS  [SOT-23-3]
R501  Res1  value 470R  [R0603[1608]]
R502  Res1  value 470R  [R0603[1608]]
R503  Res1  value 470R  [R0603[1608]]
R504  Res1  value 470R  [R0603[1608]]
R505  Res1  value 470R  [R0603[1608]]
R506  Res1  value 470R  [R0603[1608]]
R507  Res1  value 470R  [R0603[1608]]
R508  Res1  value 470R  [R0603[1608]]
R509  Res1  value 470R  [R0603[1608]]
R510  Res1  value 470R  [R0603[1608]]
R511  Res1  value 470R  [R0603[1608]]
R512  Res1  value 470R  [R0603[1608]]
R513  Res1  value 470R  [R0603[1608]]
R514  Res1  value 470R  [R0603[1608]]
R515  Res1  value 470R  [R0603[1608]]
R516  Res1  value 470R  [R0603[1608]]
R517  Res1  value 470R  [R0603[1608]]
R518  Res1  value 470R  [R0603[1608]]
R519  Res1  value 470R  [R0603[1608]]
R520  Res1  value 470R  [R0603[1608]]
R521  Res1  value 470R  [R0603[1608]]
R522  Res1  value 470R  [R0603[1608]]
R523  Res1  value 470R  [R0603[1608]]
R524  Res1  value 470R  [R0603[1608]]
R525  Res1  value 470R  [R0603[1608]]
R526  Res1  value 470R  [R0603[1608]]
R527  Res1  value 470R  [R0603[1608]]
R528_1  Res1  value 470R  [R0603[1608]]
R528_2  Res1  value 470R  [R0603[1608]]
R529  Res1  value 470R  [R0603[1608]]
R530  Res1  value 470R  [R0603[1608]]
R531  Res1  value 470R  [R0603[1608]]
R532  Res1  value 470R  [R0603[1608]]
R533  Res1  value 470R  [R0603[1608]]
R534  Res1  value 470R  [R0603[1608]]
R535  Res1  value 470R  [R0603[1608]]
R536  Res1  value 470R  [R0603[1608]]
R537  Res1  value 470R  [R0603[1608]]
R538  Res1  value 470R  [R0603[1608]]
R539  Res1  value 470R  [R0603[1608]]
R540  Res1  value 470R  [R0603[1608]]
R541  Res1  value 470R  [R0603[1608]]
R542  Res1  value 470R  [R0603[1608]]
R543  Res1  value 470R  [R0603[1608]]
R544  Res1  value 470R  [R0603[1608]]
R545  Res1  value 470R  [R0603[1608]]
R546  Res1  value 470R  [R0603[1608]]
R547  Res1  value 470R  [R0603[1608]]
R548  Res1  value 470R  [R0603[1608]]
R549  Res1  value 470R  [R0603[1608]]
R550  Res1  value 470R  [R0603[1608]]
R551  Res1  value 470R  [R0603[1608]]
R552  Res1  value 470R  [R0603[1608]]
R553  Res1  value 470R  [R0603[1608]]
R554  Res1  value 470R  [R0603[1608]]
R554_2  Res1  value 470R  [R0603[1608]]
R555  Res1  value 470R  [R0603[1608]]
R556  Res1  value 470R  [R0603[1608]]
R556_2  Res1  value 470R  [R0603[1608]]
R557  Res1  value 470R  [R0603[1608]]
R558  Res1  value 470R  [R0603[1608]]
R559  Res1  value 470R  [R0603[1608]]
R561_1  Res1  value 470R  [R0603[1608]]
R561_2  Res1  value 470R  [R0603[1608]]
R563  Res1  value 470R  [R0603[1608]]
R565  Res1  value 470R  [R0603[1608]]
R566  Res1  value 470R  [R0603[1608]]
R567  Res1  value 470R  [R0603[1608]]
R567_1  Res1  value 470R  [R0603[1608]]
R567_2  Res1  value 470R  [R0603[1608]]
R568  Res1  value 2M  [R0603[1608]]
R569  Res1  value 470R  [R0603[1608]]
R570  Res1  value 100k  [R0603[1608]]
R571  Res1  value 470R  [R0603[1608]]
R654  Res1  value 470R  [R0603[1608]]

### Ports
POWER_PIN

### Nets
GND: Q502.2(S) R501.1 R502.1 R503.1 R504.1 R505.1 R506.1 R507.1 R508.1 R509.1 R510.1 R511.1 R512.1 R513.1 R514.1 R515.1 R516.1 R517.1 R518.1 R519.1 R520.1 R521.1 R522.1 R523.1 R524.1 R525.1 R526.1 R527.1 R528_1.1 R528_2.1 R529.1 R530.1 R531.1 R532.1 R533.1 R534.1 R535.1 R536.1 R537.1 R538.1 R539.1 R540.1 R541.1 R542.1 R543.1 R544.1 R545.1 R546.1 R547.1 R548.1 R549.1 R550.1 R551.1 R552.1 R553.1 R554.1 R554_2.1 R555.1 R556.1 R556_2.1 R557.1 R558.1 R559.1 R561_1.1 R561_2.1 R563.1 R565.1 R566.1 R567.1 R567_1.1 R567_2.1 R570.2 R571.1 R654.1
VCC5V: Q501.2(S) R568.2
VCC_EXT: D501.1(A) D502.1(A) D503.1(A) D504.1(A) D505.1(A) D506.1(A) D507.1(A) D508.1(A) D509.1(A) D510.1(A) D511.1(A) D512.1(A) D513.1(A) D514.1(A) D515.1(A) D516.1(A) D517.1(A) D518.1(A) D519.1(A) D520.1(A) D521.1(A) D522.1(A) D523.1(A) D524.1(A) D525.1(A) D526.1(A) D527.1(A) D528_1.1(A) D528_2.1(A) D529.1(A) D530.1(A) D531.1(A) D532.1(A) D533.1(A) D534.1(A) D535.1(A) D536.1(A) D537.1(A) D538.1(A) D539.1(A) D540.1(A) D541.1(A) D542.1(A) D543.1(A) D544_1.1(A) D544_2.1(A) D545.1(A) D546.1(A) D547.1(A) D548.1(A) D549.1(A) D550.1(A) D551.1(A) D552.1(A) D553.1(A) D554.1(A) D555.1(A) D556_1.1(A) D556_2.1(A) D557.1(A) D558.1(A) D559.1(A) D561_1.1(A) D561_2.1(A) D563.1(A) D564.1(A) D565.1(A) D566.1(A) D567.1(A) D567_1.1(A) D567_2.1(A) D568.1(A) Q501.3(D)
switch_led: R569.1 ; port POWER_PIN
NetD501_2: D501.2(K) R501.2
NetD502_2: D502.2(K) R502.2
NetD503_2: D503.2(K) R503.2
NetD504_2: D504.2(K) R504.2
NetD505_2: D505.2(K) R505.2
NetD506_2: D506.2(K) R506.2
NetD507_2: D507.2(K) R507.2
NetD508_2: D508.2(K) R508.2
NetD509_2: D509.2(K) R509.2
NetD510_2: D510.2(K) R510.2
NetD511_2: D511.2(K) R511.2
NetD512_2: D512.2(K) R512.2
NetD513_2: D513.2(K) R513.2
NetD514_2: D514.2(K) R514.2
NetD515_2: D515.2(K) R515.2
NetD516_2: D516.2(K) R516.2
NetD517_2: D517.2(K) R517.2
NetD518_2: D518.2(K) R518.2
NetD519_2: D519.2(K) R519.2
NetD520_2: D520.2(K) R520.2
NetD521_2: D521.2(K) R521.2
NetD522_2: D522.2(K) R522.2
NetD523_2: D523.2(K) R523.2
NetD524_2: D524.2(K) R524.2
NetD525_2: D525.2(K) R525.2
NetD526_2: D526.2(K) R526.2
NetD527_2: D527.2(K) R527.2
NetD528_1_2: D528_1.2(K) R528_1.2
NetD528_2_2: D528_2.2(K) R528_2.2
NetD529_2: D529.2(K) R529.2
NetD530_2: D530.2(K) R530.2
NetD531_2: D531.2(K) R531.2
NetD532_2: D532.2(K) R532.2
NetD533_2: D533.2(K) R533.2
NetD534_2: D534.2(K) R534.2
NetD535_2: D535.2(K) R535.2
NetD536_2: D536.2(K) R536.2
NetD537_2: D537.2(K) R537.2
NetD538_2: D538.2(K) R538.2
NetD539_2: D539.2(K) R539.2
NetD540_2: D540.2(K) R540.2
NetD541_2: D541.2(K) R541.2
NetD542_2: D542.2(K) R542.2
NetD543_2: D543.2(K) R543.2
NetD544_1_2: D544_1.2(K) R544.2
NetD544_2_2: D544_2.2(K) R554_2.2
NetD545_2: D545.2(K) R545.2
NetD546_2: D546.2(K) R546.2
NetD547_2: D547.2(K) R547.2
NetD548_2: D548.2(K) R548.2
NetD549_2: D549.2(K) R549.2
NetD550_2: D550.2(K) R550.2
NetD551_2: D551.2(K) R551.2
NetD552_2: D552.2(K) R552.2
NetD553_2: D553.2(K) R553.2
NetD554_2: D554.2(K) R554.2
NetD555_2: D555.2(K) R555.2
NetD556_1_2: D556_1.2(K) R556.2
NetD556_2_2: D556_2.2(K) R556_2.2
NetD557_2: D557.2(K) R557.2
NetD558_2: D558.2(K) R558.2
NetD559_2: D559.2(K) R559.2
NetD561_1_2: D561_1.2(K) R561_1.2
NetD561_2_2: D561_2.2(K) R561_2.2
NetD563_2: D563.2(K) R563.2
NetD564_2: D564.2(K) R654.2
NetD565_2: D565.2(K) R565.2
NetD566_2: D566.2(K) R566.2
NetD567_1_2: D567_1.2(K) R567_1.2
NetD567_2: D567.2(K) R567.2
NetD567_2_2: D567_2.2(K) R567_2.2
NetD568_2: D568.2(K) R571.2
NetQ501_1: Q501.1(G) Q502.3(D) R568.1
NetQ502_1: Q502.1(G) R569.2 R570.1

### Notes on the sheet
- Title
- Size:
- Date:
- A3
- Number:
- Time:
- Revision:
- Sheet
- of
- File:

### Library data of the parts
D501-D527 D528_1 D528_2 D529-D543 D544_1 D544_2 D545-D555 D556_1 D556_2 D557-D559 D561_1 D561_2 D563-D567 D567_1 D567_2 D568 = LED0: Typical INFRARED GaAs LED
Q501 = PMOS-2: as Q301 on sheet 3_viper_eagle_rep-mcu; LCSC Part #: C10487; Version: SOT23-3
Q502 = MOSFET-N: as Q302 on sheet 3_viper_eagle_rep-mcu; LCSC Part #: C8545; MRF.Part: 2N7002
R501-R527 R528_1 R528_2 R529-R554 R554_2 R555 R556 R556_2 R557-R559 R561_1 R561_2 R563 R565-R567 R567_1 R567_2 R569 R571 R654 = Res1: as R308 on sheet 3_viper_eagle_rep-mcu; Version: 0603 imperial; LCSC Part #: C23179
R568 = Res1: Resistor; MRF.Part: 0603WAF2004T5E; LCSC MFG: Uniroyal Elec; Version: 0603 imperial; LCSC Part #: C22976
R570 = Res1: as R305 on sheet 3_viper_eagle_rep-mcu; Version: 0603 imperial; LCSC Part #: C25803

## Nets that join several sheets
GND: 3_viper_eagle_rep-mcu (27 pins), 4_viper_eagle_rep-periferals (32 pins), 5_viper_eagle_rep-swleds (74 pins)
VCC5V: 3_viper_eagle_rep-mcu (5 pins), 4_viper_eagle_rep-periferals (24 pins), 5_viper_eagle_rep-swleds (Q501.2 R568.2)
col1: 3_viper_eagle_rep-mcu (U301.10), 2_viper_eagle_rep-matrix (10 pins)
col2: 3_viper_eagle_rep-mcu (U301.13), 2_viper_eagle_rep-matrix (9 pins)
col3: 3_viper_eagle_rep-mcu (U301.14), 2_viper_eagle_rep-matrix (9 pins)
col4: 3_viper_eagle_rep-mcu (U301.17), 2_viper_eagle_rep-matrix (9 pins)
col5: 3_viper_eagle_rep-mcu (U301.41), 2_viper_eagle_rep-matrix (10 pins)
col6: 3_viper_eagle_rep-mcu (U301.40), 2_viper_eagle_rep-matrix (10 pins)
col7: 3_viper_eagle_rep-mcu (U301.39), 2_viper_eagle_rep-matrix (10 pins)
NetLED406_4: 3_viper_eagle_rep-mcu (R308.2), 4_viper_eagle_rep-periferals (LED406.4)
PA1: 3_viper_eagle_rep-mcu (U301.11), 2_viper_eagle_rep-matrix (7 pins)
PA2: 3_viper_eagle_rep-mcu (U301.12), 2_viper_eagle_rep-matrix (7 pins)
PA9: 3_viper_eagle_rep-mcu (U301.30), 4_viper_eagle_rep-periferals (R423.1)
PA10: 3_viper_eagle_rep-mcu (U301.31), 2_viper_eagle_rep-matrix (7 pins)
PA15: 3_viper_eagle_rep-mcu (U301.38), 2_viper_eagle_rep-matrix (7 pins)
PB0: 3_viper_eagle_rep-mcu (U301.18), 4_viper_eagle_rep-periferals (R419.1)
PB1: 3_viper_eagle_rep-mcu (U301.19), 4_viper_eagle_rep-periferals (R409.1)
PB6: 3_viper_eagle_rep-mcu (U301.42), 2_viper_eagle_rep-matrix (7 pins)
PB7: 3_viper_eagle_rep-mcu (U301.43), 2_viper_eagle_rep-matrix (7 pins)
PB8: 3_viper_eagle_rep-mcu (U301.45), 2_viper_eagle_rep-matrix (7 pins)
PB9: 3_viper_eagle_rep-mcu (U301.46), 4_viper_eagle_rep-periferals (R421.1)
PB12: 3_viper_eagle_rep-mcu (U301.25), 4_viper_eagle_rep-periferals (R411.1)
PB13: 3_viper_eagle_rep-mcu (U301.26), 4_viper_eagle_rep-periferals (R413.1)
PB14: 3_viper_eagle_rep-mcu (U301.27), 4_viper_eagle_rep-periferals (R415.1)
PB15: 3_viper_eagle_rep-mcu (U301.28), 4_viper_eagle_rep-periferals (R417.1)
PC13: 3_viper_eagle_rep-mcu (U301.2), 2_viper_eagle_rep-matrix (7 pins)
PC14: 3_viper_eagle_rep-mcu (U301.3), 2_viper_eagle_rep-matrix (D257.2 D262.2 D264.2 D266.2)
PC15: 3_viper_eagle_rep-mcu (U301.4), 2_viper_eagle_rep-matrix (7 pins)
switch_led: 3_viper_eagle_rep-mcu (U301.16), 5_viper_eagle_rep-swleds (R569.1)